# Altium schematic sheet EntradaSensores.SchDoc: CONTROLADORA AIRPOPCORN
size A3; DocumentNumber: 8; SheetNumber: 8; SheetTotal: 15
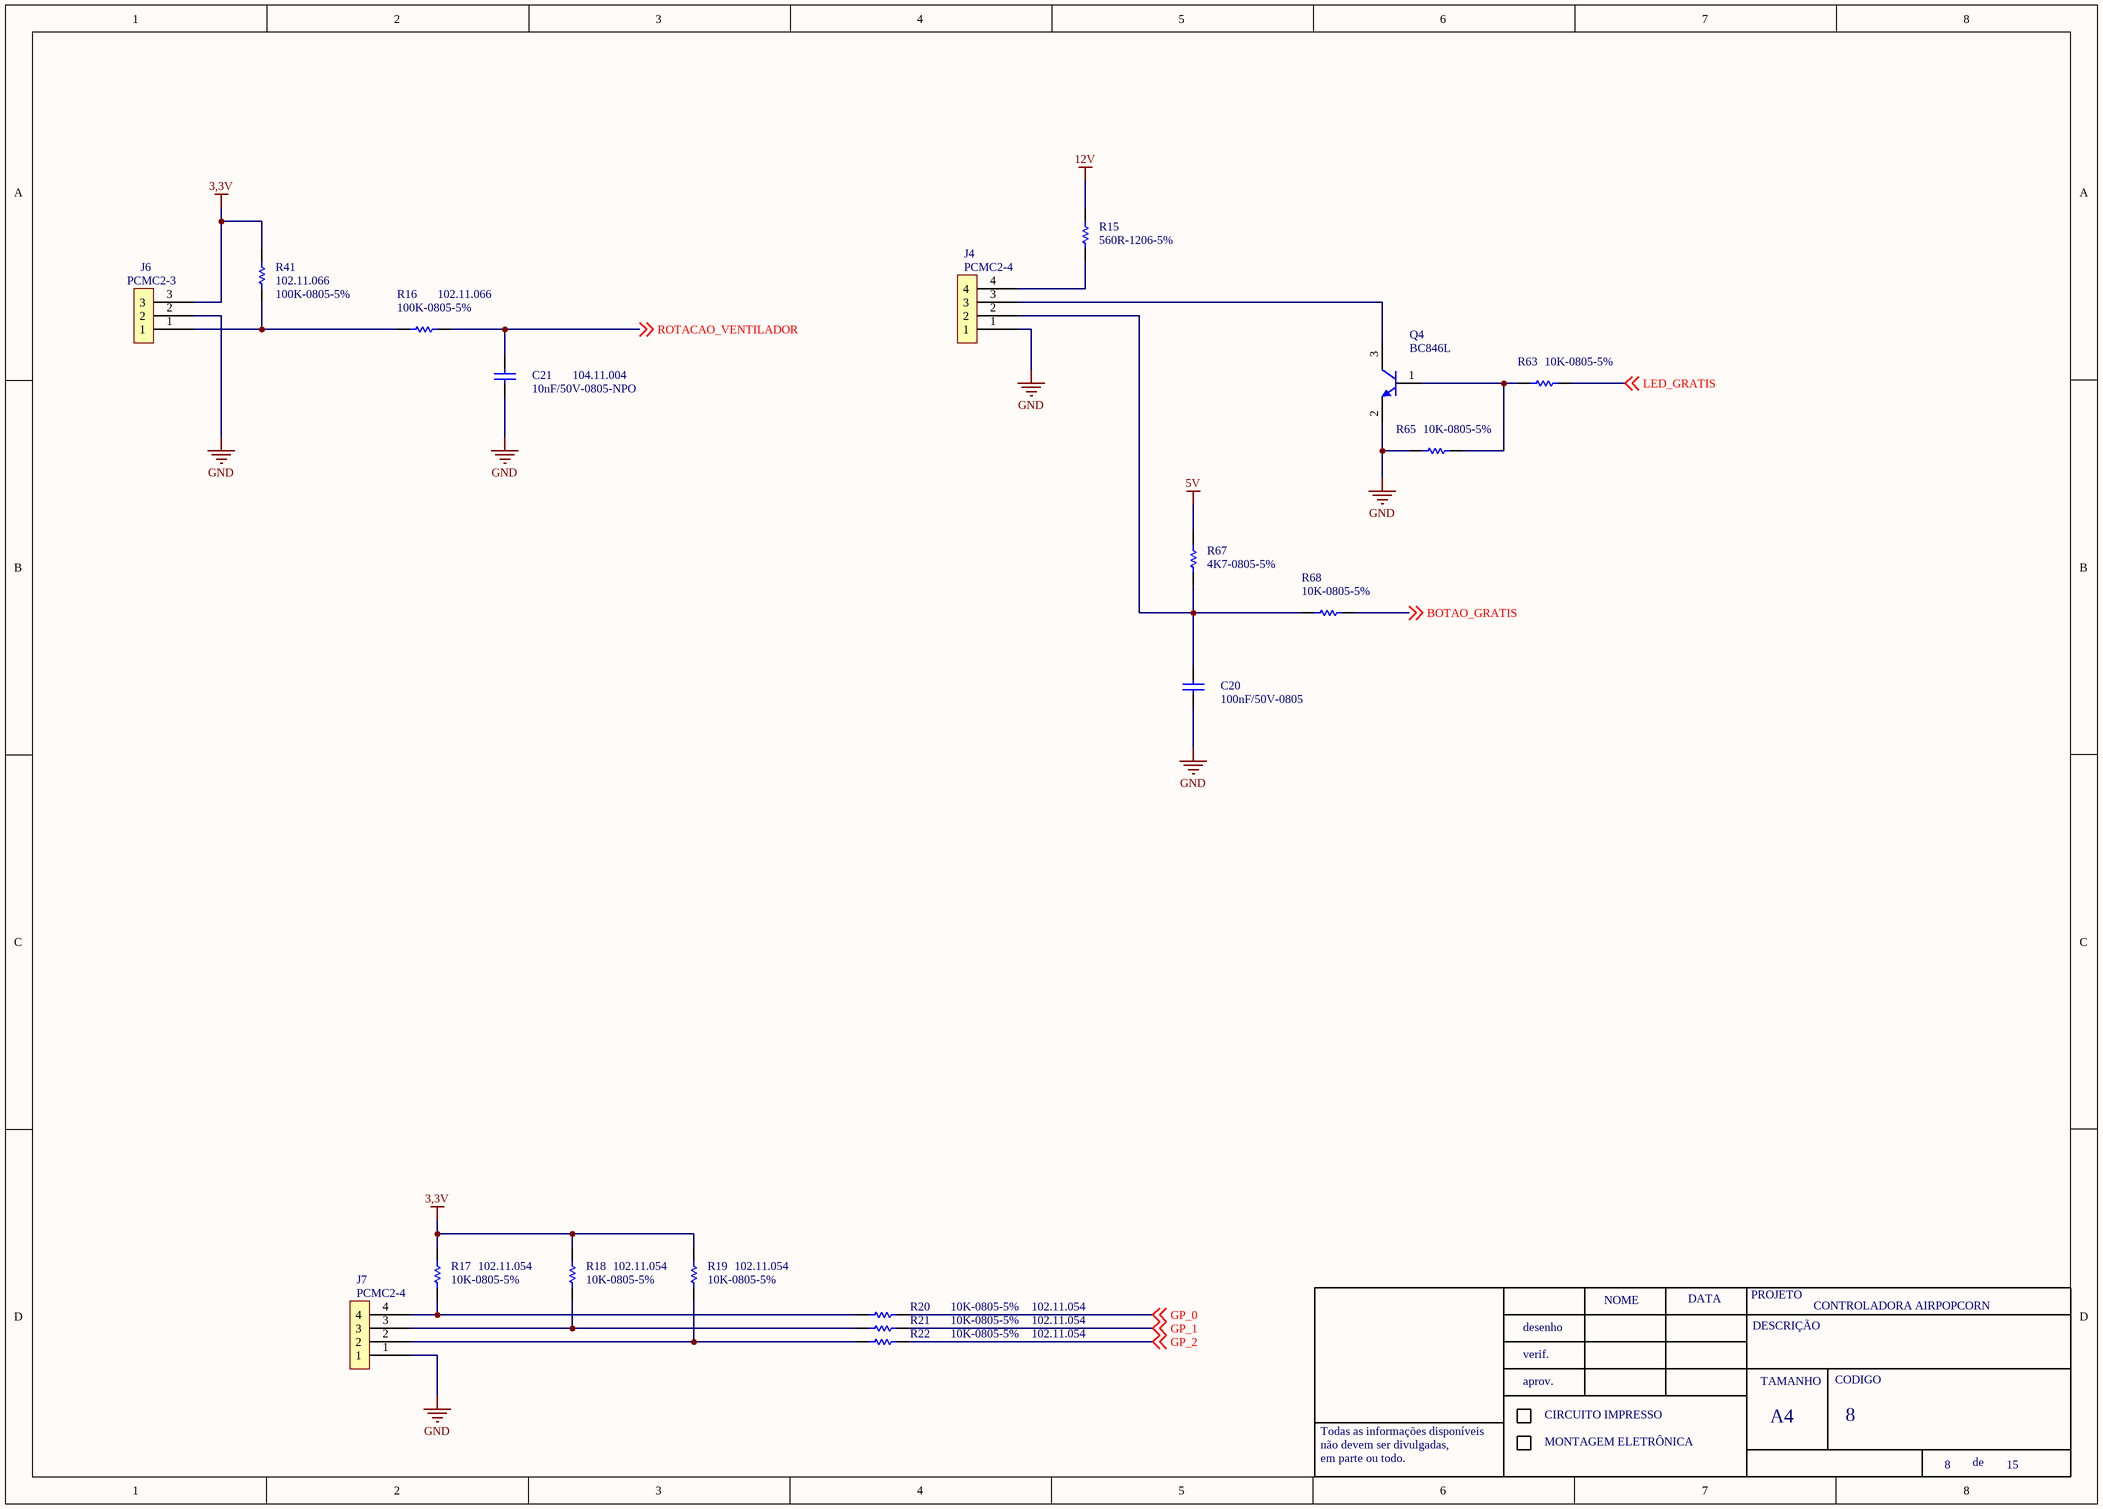
[diagram p0: EntradaSensores.SchDoc]

## Parts
C20  100nF/50V-0805
C21  10nF/50V-0805-NPO  ERP: 104.11.004  [0805-REVISADO ONDA]
J4  PCMC2-4  [PCMC2-4]
J6  PCMC2-3  [PCMC2-3]
J7  PCMC2-4  [PCMC2-4]
Q4  BC846L
R15  560R-1206-5%
R16  100K-0805-5%  ERP: 102.11.066  [0805-REVISADO ONDA]
R17  10K-0805-5%  ERP: 102.11.054  [0805-REVISADO ONDA]
R18  10K-0805-5%  ERP: 102.11.054  [0805-REVISADO ONDA]
R19  10K-0805-5%  ERP: 102.11.054  [0805-REVISADO ONDA]
R20  10K-0805-5%  ERP: 102.11.054  [0805-REVISADO ONDA]
R21  10K-0805-5%  ERP: 102.11.054  [0805-REVISADO ONDA]
R22  10K-0805-5%  ERP: 102.11.054  [0805-REVISADO ONDA]
R41  100K-0805-5%  ERP: 102.11.066  [0805-REVISADO ONDA]
R63  10K-0805-5%
R65  10K-0805-5%
R67  4K7-0805-5%
R68  10K-0805-5%

## Nets
3,3V: J6.3 R17.2 R18.2 R19.2 R41.2
5V: R67.2
12V: R15.1
GND: C20.1 C21.1 J4.1 J6.2 J7.1 Q4.2(E) R65.1
BOTAO_GRATIS: R68.1 ; off-sheet BOTAO_GRATIS
GP_0: R20.2 ; off-sheet GP_0
GP_1: R21.2 ; off-sheet GP_1
GP_2: R22.2 ; off-sheet GP_2
LED_GRATIS: R63.2 ; off-sheet LED_GRATIS
ROTACAO_VENTILADOR: C21.2 R16.2 ; off-sheet ROTACAO_VENTILADOR
NetC20_2: C20.2 J4.2 R67.1 R68.2
NetJ4_3: J4.3 Q4.3(C)
NetJ4_4: J4.4 R15.2
NetJ6_1: J6.1 R16.1 R41.1
NetJ7_2: J7.2 R19.1 R22.1
NetJ7_3: J7.3 R18.1 R21.1
NetJ7_4: J7.4 R17.1 R20.1
NetQ4_1: Q4.1(B) R63.1 R65.2

## Notes on the sheet
- NOME
- DATA
- PROJETO
- DESCRIÇÃO
- desenho
- verif.
- aprov.
- TAMANHO
- CODIGO
- Todas as informações disponíveis
- não devem ser divulgadas,
- em parte ou todo.
- CIRCUITO IMPRESSO
- MONTAGEM ELETRÔNICA
- A4
- de

## Library data of the parts
C20 = 100nF/50-0805-NPO: ERP: 104.11.005
Q4 = BC846: ERP: 106.22.001
R15 = 1K2-0805-1%: ERP: 102.11.106
R67 = 4K7-1206-5%: ERP: 102.12.050
R17-R22 R63 R65 R68 = 10K-0805-5%
  R63 R65 R68: ERP: 102.11.054